# EAGLE schematic G888a (EAGLE 4.11)
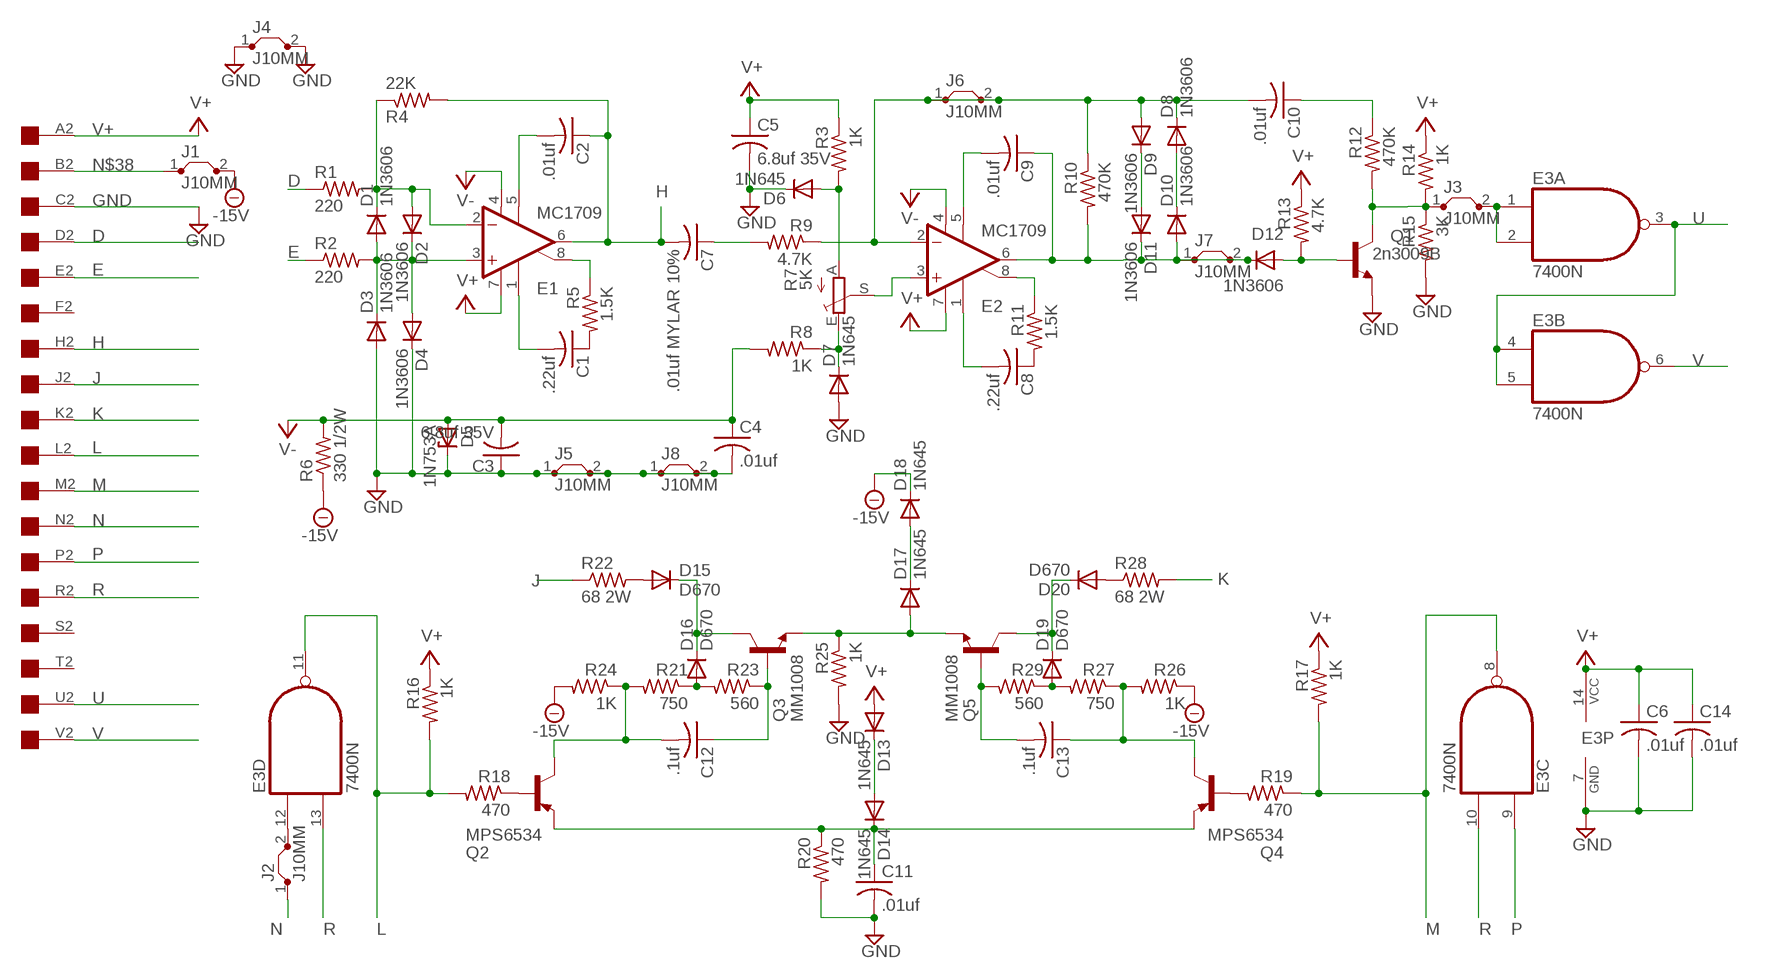
[diagram p0: schematic, sheet 1]

## Parts
C1  .22uf  C-US050-025X075  [C050-025X075]
C2  .01uf  C-US050-025X075  [C050-025X075]
C3  6.8uf 35V  C-US102-043X133  [C102-043X133]
C4  .01uf  C-US050-025X075  [C050-025X075]
C5  6.8uf 35V  C-US102-043X133  [C102-043X133]
C6  .01uf  C-US050-025X075  [C050-025X075]
C7  .01uf MYLAR 10%  C-US150-054X183  [C150-054X183]
C8  .22uf  C-US050-025X075  [C050-025X075]
C9  .01uf  C-US050-025X075  [C050-025X075]
C10  .01uf  C-US050-025X075  [C050-025X075]
C11  .01uf  C-US050-025X075  [C050-025X075]
C12  .1uf  C-US050-025X075  [C050-025X075]
C13  .1uf  C-US050-025X075  [C050-025X075]
C14  .01uf  C-US050-025X075  [C050-025X075]
D1  1N3606  1N4004  [DO41-10]
D2  1N3606  1N4004  [DO41-10]
D3  1N3606  1N4004  [DO41-10]
D4  1N3606  1N4004  [DO41-10]
D5  1N753A  ZENER-DIODEDO35Z10  [DO35Z10]
D6  1N645  1N4004  [DO41-10]
D7  1N645  1N4004  [DO41-10]
D8  1N3606  1N4004  [DO41-10]
D9  1N3606  1N4004  [DO41-10]
D10  1N3606  1N4004  [DO41-10]
D11  1N3606  1N4004  [DO41-10]
D12  1N3606  1N4004  [DO41-10]
D13  1N645  1N4004  [DO41-10]
D14  1N645  1N4004  [DO41-10]
D15  D670  1N4004  [DO41-10]
D16  D670  1N4004  [DO41-10]
D17  1N645  1N4004  [DO41-10]
D18  1N645  1N4004  [DO41-10]
D19  D670  1N4004  [DO41-10]
D20  D670  1N4004  [DO41-10]
E1  MC1709  LM3080N  [DIL08]
E2  MC1709  LM3080N  [DIL08]
E3  7400N  [DIL14]
J1  J10MM  [10]
J2  J10MM  [10]
J3  J10MM  [10]
J4  J10MM  [10]
J5  J10MM  [10]
J6  J10MM  [10]
J7  J10MM  [10]
J8  J10MM  [10]
Q1  2n3009B  2N1711  [TO39]
Q2  MPS6534  2N5415  [TO39]
Q3  MM1008  2N1711  [TO39]
Q4  MPS6534  2N5415  [TO39]
Q5  MM1008  2N1711  [TO39]
R1  220  R-US_0207/10  [0207/10]
R2  220  R-US_0207/10  [0207/10]
R3  1K  R-US_0207/10  [0207/10]
R4  22K  R-US_0207/10  [0207/10]
R5  1.5K  R-US_0207/10  [0207/10]
R6  330 1/2W  R-US_0411/15  [0411/15]
R7  5K  TRIM_EU-PTSPIN  [PT-SPIN]
R8  1K  R-US_0207/10  [0207/10]
R9  4.7K  R-US_0207/10  [0207/10]
R10  470K  R-US_0207/10  [0207/10]
R11  1.5K  R-US_0207/10  [0207/10]
R12  470K  R-US_0207/10  [0207/10]
R13  4.7K  R-US_0207/10  [0207/10]
R14  1K  R-US_0207/10  [0207/10]
R15  3K  R-US_0207/10  [0207/10]
R16  1K  R-US_0207/10  [0207/10]
R17  1K  R-US_0207/10  [0207/10]
R18  470  R-US_0207/10  [0207/10]
R19  470  R-US_0207/10  [0207/10]
R20  470  R-US_0207/10  [0207/10]
R21  750  R-US_0207/10  [0207/10]
R22  68 2W  R-US_0817/22  [P0817/22]
R23  560  R-US_0207/10  [0207/10]
R24  1K  R-US_0207/10  [0207/10]
R25  1K  R-US_0207/10  [0207/10]
R26  1K  R-US_0207/10  [0207/10]
R27  750  R-US_0207/10  [0207/10]
R28  68 2W  R-US_0817/22  [P0817/22]
R29  560  R-US_0207/10  [0207/10]
U$5  ONE-SIDED  [ONE-SIDED]

## Nets
-15V: D18.C J1.2 R6.1 R24.2 R26.1
D: R1.1 U$5.D2
E: R2.1 U$5.E2
GND: C3.1 C4.2 C5.2 C6.2 C11.2 C14.2 D3.A D4.C D5.C D6.C D7.A E3.7(P:GND) J4.1 J4.2 J5.1 J5.2 J8.1 J8.2 Q1.1(E) R15.2 R20.2 R25.2 U$5.C2
H: C2.1 C7.2 E1.6(OUT) R4.2 U$5.H2
J: R22.1 U$5.J2
K: R28.2 U$5.K2
L: E3.11(D:O) R16.2 R18.2 U$5.L2
M: E3.8(C:O) R17.2 R19.1 U$5.M2
N: J2.1 U$5.N2
N$1: C1.1 R5.2
N$2: C8.1 R11.2
N$3: D1.C D2.A E1.2(-IN) R1.2 R4.1
N$4: D1.A D2.C D3.C D4.A E1.3(+IN) R2.2
N$5: C8.2 E2.1(ON1)
N$6: C1.2 E1.1(ON1)
N$7: E1.8(ON2) R5.1
N$8: C2.2 E1.5(OPT)
N$9: D6.A R3.2 R7.A
N$10: C10.2 D8.C D9.A E2.2(-IN) J6.1 J6.2 R9.1 R10.1
N$11: E2.3(+IN) R7.S
N$12: D7.C R7.E R8.1
N$13: E2.8(ON2) R11.1
N$14: C9.2 E2.5(OPT)
N$15: C9.1 D10.A D11.C D12.C E2.6(OUT) J7.1 J7.2 R10.2
N$16: C7.1 R9.2
N$17: D9.C D11.A
N$18: D8.A D10.C
N$19: C10.1 R12.1
N$20: D12.A Q1.2(B) R13.2
N$21: J3.1 Q1.3(C) R12.2 R14.2 R15.1
N$22: D17.A Q3.1(E) Q5.1(E) R25.1
N$23: C11.1 D14.C Q2.1(E) Q4.1(E) R20.1
N$24: D13.C D14.A
N$25: Q2.2(B) R18.1
N$26: Q4.2(B) R19.2
N$27: D15.A R22.2
N$28: D16.A R21.1 R23.2
N$29: C12.2 Q2.3(C) R21.2 R24.1
N$30: C12.1 Q3.2(B) R23.1
N$31: D19.A R27.2 R29.1
N$32: C13.1 Q4.3(C) R26.2 R27.1
N$33: C13.2 Q5.2(B) R29.2
N$34: D20.A R28.1
N$35: D15.C D16.C Q3.3(C)
N$36: D19.C D20.C Q5.3(C)
N$37: D17.C D18.A
N$38: J1.1 U$5.B2
N$39: E3.12(D:I0) J2.2
N$40: E3.1(A:I0) E3.2(A:I1) J3.2
P: E3.9(C:I0) U$5.P2
R: E3.10(C:I1) E3.13(D:I1) U$5.R2
U: E3.3(A:O) E3.4(B:I0) E3.5(B:I1) U$5.U2
V: E3.6(B:O) U$5.V2
V+: C5.1 C6.1 C14.1 D13.A E1.7(V+) E2.7(V+) E3.14(P:VCC) R3.1 R13.1 R14.1 R16.1 R17.1 U$5.A2
V-: C3.2 C4.1 D5.A E1.4(V-) E2.4(V-) R6.2 R8.2
Unconnected: U$5.F2 U$5.S2 U$5.T2

## Library data of the parts
C1-C14 = rcl:C-US: CAPACITOR, American symbol
D1-D4 D6-D20 = diode:1N4004: DIODE general purpose rectifier, 1 A
D5 = diode:ZENER-DIODE: Z-Diode
E1 E2 = linear:*3080: OP AMP
E3 = 74xx-us:74*00: Quad 2-input NAND gate
J1-J8 = jumper:J: Bridge
Q1 Q3 Q5 = transistor-npn:2N1711: NPN Transistor
Q2 Q4 = transistor-pnp:2N5415*: PNP Transistror
R1-R6 R8-R29 = rcl:R-US_: RESISTOR, American symbol
R7 = pot:TRIM_EU-: POTENTIOMETER
U$5 = con-dec:ONE-SIDED: One-sided DEC Flip-Chip single card fingers